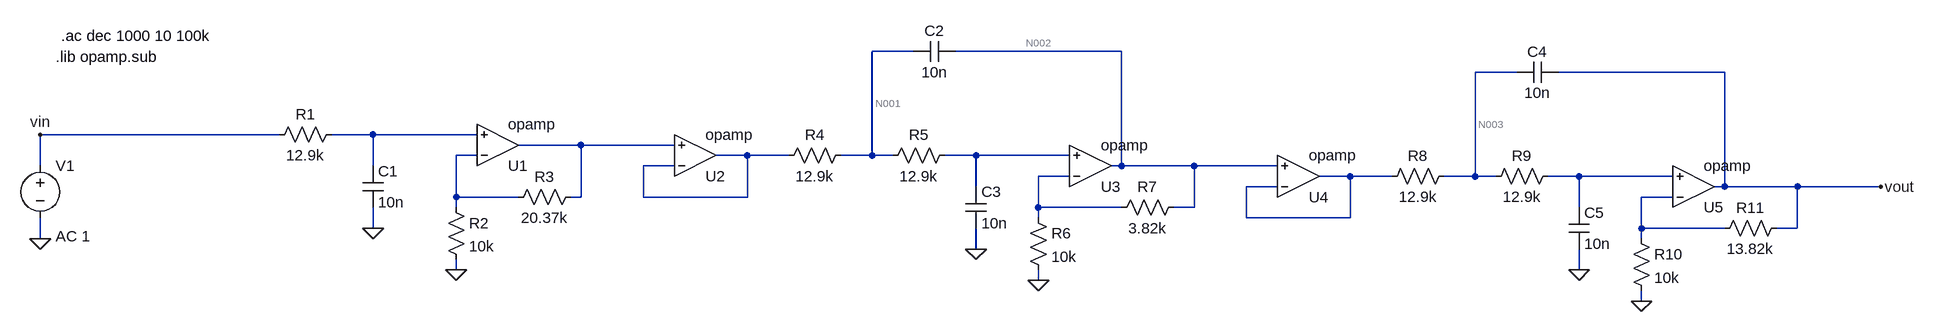
[diagram p0: schematic Draft1.asc]
Draft1.asc, the LTspice schematic file:
Version 4.1
SHEET 1 2884 680
WIRE 1328 -64 1264 -64
WIRE 1648 -64 1392 -64
WIRE 2256 -32 2192 -32
WIRE 2576 -32 2320 -32
WIRE 352 64 -16 64
WIRE 496 64 432 64
WIRE 656 64 496 64
WIRE 816 80 720 80
WIRE 960 80 816 80
WIRE 656 96 624 96
WIRE 1072 96 1024 96
WIRE 1136 96 1072 96
WIRE 1264 96 1264 -64
WIRE 1264 96 1216 96
WIRE 1296 96 1264 96
WIRE 1424 96 1376 96
WIRE 1568 96 1424 96
WIRE -16 112 -16 64
WIRE 496 112 496 64
WIRE 960 112 912 112
WIRE 1648 112 1648 -64
WIRE 1648 112 1632 112
WIRE 1760 112 1648 112
WIRE 1888 112 1760 112
WIRE 1568 128 1520 128
WIRE 2000 128 1952 128
WIRE 2064 128 2000 128
WIRE 2192 128 2192 -32
WIRE 2192 128 2144 128
WIRE 2224 128 2192 128
WIRE 2352 128 2304 128
WIRE 2496 128 2352 128
WIRE 1424 144 1424 96
WIRE 1888 144 1840 144
WIRE 2576 144 2576 -32
WIRE 2576 144 2560 144
WIRE 2688 144 2576 144
WIRE 2816 144 2688 144
WIRE 624 160 624 96
WIRE 720 160 624 160
WIRE 816 160 816 80
WIRE 816 160 800 160
WIRE 912 160 912 112
WIRE 1072 160 1072 96
WIRE 1072 160 912 160
WIRE 2496 160 2448 160
WIRE 624 176 624 160
WIRE 1520 176 1520 128
WIRE 1648 176 1520 176
WIRE 1760 176 1760 112
WIRE 1760 176 1728 176
WIRE 2352 176 2352 128
WIRE 1520 192 1520 176
WIRE 1840 192 1840 144
WIRE 2000 192 2000 128
WIRE 2000 192 1840 192
WIRE 496 208 496 176
WIRE 2448 208 2448 160
WIRE 2576 208 2448 208
WIRE 2688 208 2688 144
WIRE 2688 208 2656 208
WIRE -16 224 -16 192
WIRE 2448 224 2448 208
WIRE 1424 240 1424 208
WIRE 624 272 624 256
WIRE 2352 272 2352 240
WIRE 1520 288 1520 272
WIRE 2448 320 2448 304
FLAG -16 224 0
FLAG 496 208 0
FLAG 624 272 0
FLAG 1424 240 0
FLAG 1520 288 0
FLAG 2352 272 0
FLAG 2448 320 0
FLAG 2816 144 vout
FLAG -16 64 vin
SYMBOL voltage -16 96 R0
WINDOW 123 24 124 Left 2
WINDOW 39 0 0 Left 0
SYMATTR InstName V1
SYMATTR Value ""
SYMATTR Value2 AC 1
SYMBOL res 448 48 R90
WINDOW 0 0 56 VBottom 2
WINDOW 3 32 56 VTop 2
SYMATTR InstName R1
SYMATTR Value 12.9k
SYMBOL cap 480 112 R0
SYMATTR InstName C1
SYMATTR Value 10n
SYMBOL OpAmps\\opamp 688 144 M180
SYMATTR InstName U1
SYMBOL res 608 160 R0
SYMATTR InstName R2
SYMATTR Value 10k
SYMBOL res 816 144 R90
WINDOW 0 0 56 VBottom 2
WINDOW 3 32 56 VTop 2
SYMATTR InstName R3
SYMATTR Value 20.37k
SYMBOL OpAmps\\opamp 992 160 M180
SYMATTR InstName U2
SYMBOL res 1232 80 R90
WINDOW 0 0 56 VBottom 2
WINDOW 3 32 56 VTop 2
SYMATTR InstName R4
SYMATTR Value 12.9k
SYMBOL res 1280 112 R270
WINDOW 0 32 56 VTop 2
WINDOW 3 0 56 VBottom 2
SYMATTR InstName R5
SYMATTR Value 12.9k
SYMBOL cap 1392 -80 R90
WINDOW 0 0 32 VBottom 2
WINDOW 3 32 32 VTop 2
SYMATTR InstName C2
SYMATTR Value 10n
SYMBOL cap 1408 144 R0
SYMATTR InstName C3
SYMATTR Value 10n
SYMBOL res 1504 176 R0
SYMATTR InstName R6
SYMATTR Value 10k
SYMBOL res 1744 160 R90
WINDOW 0 0 56 VBottom 2
WINDOW 3 32 56 VTop 2
SYMATTR InstName R7
SYMATTR Value 3.82k
SYMBOL OpAmps\\opamp 1600 176 M180
SYMATTR InstName U3
SYMBOL OpAmps\\opamp 1920 192 M180
SYMATTR InstName U4
SYMBOL res 2160 112 R90
WINDOW 0 0 56 VBottom 2
WINDOW 3 32 56 VTop 2
SYMATTR InstName R8
SYMATTR Value 12.9k
SYMBOL res 2208 144 R270
WINDOW 0 32 56 VTop 2
WINDOW 3 0 56 VBottom 2
SYMATTR InstName R9
SYMATTR Value 12.9k
SYMBOL cap 2320 -48 R90
WINDOW 0 0 32 VBottom 2
WINDOW 3 32 32 VTop 2
SYMATTR InstName C4
SYMATTR Value 10n
SYMBOL cap 2336 176 R0
SYMATTR InstName C5
SYMATTR Value 10n
SYMBOL res 2432 208 R0
SYMATTR InstName R10
SYMATTR Value 10k
SYMBOL res 2672 192 R90
WINDOW 0 0 56 VBottom 2
WINDOW 3 32 56 VTop 2
SYMATTR InstName R11
SYMATTR Value 13.82k
SYMBOL OpAmps\\opamp 2528 208 M180
SYMATTR InstName U5
TEXT 8 -56 Left 2 !.lib opamp.sub
TEXT 16 -88 Left 2 !.ac dec 1000 10 100k

The netlist it stands for:
* Draft1.asc
V1 vin 0 AC 1
R1 N004 vin 12.9k
C1 N004 0 10n
X§U1 N006 N004 N005 opamp Aol=100K GBW=10Meg  ; pins invin noninvin out
R2 N006 0 10k
R3 N005 N006 20.37k
X§U2 N007 N005 N007 opamp Aol=100K GBW=10Meg  ; pins invin noninvin out
R4 N001 N007 12.9k
R5 N001 N008 12.9k
C2 N002 N001 10n
C3 N008 0 10n
R6 N009 0 10k
R7 N002 N009 3.82k
X§U3 N009 N008 N002 opamp Aol=100K GBW=10Meg  ; pins invin noninvin out
X§U4 N010 N002 N010 opamp Aol=100K GBW=10Meg  ; pins invin noninvin out
R8 N003 N010 12.9k
R9 N003 N011 12.9k
C4 vout N003 10n
C5 N011 0 10n
R10 N012 0 10k
R11 vout N012 13.82k
X§U5 N012 N011 vout opamp Aol=100K GBW=10Meg  ; pins invin noninvin out
.lib opamp.sub
.ac dec 1000 10 100k
.backanno
.end

* Results of the author's LTspice run, read from the files saved beside the schematic
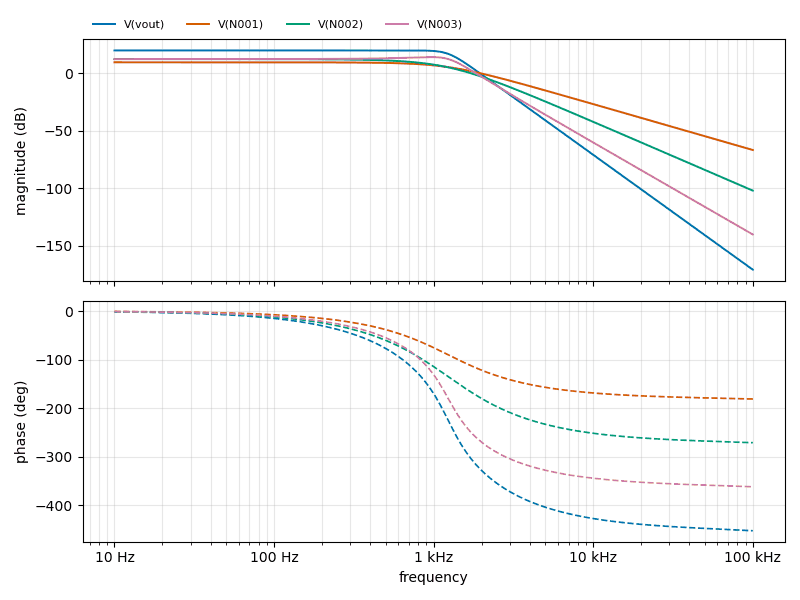
[diagram p1: AC Analysis of Draft1.asc, plotted from the saved traces]
* AC Analysis, 1 run:
*   V(vout): 20.00 dB at 10 Hz, -170.90 dB at 100 kHz, peak 20.00 dB at 460.3 Hz, 3 dB below the peak at 1.234 kHz
*   V(N001): 9.65 dB at 10 Hz, -66.71 dB at 100 kHz, peak 9.65 dB at 10 Hz, 3 dB below the peak at 1.06 kHz
*   V(N002): 12.46 dB at 10 Hz, -102.08 dB at 100 kHz, peak 12.46 dB at 10 Hz, 3 dB below the peak at 788.9 Hz
*   V(N003): 12.46 dB at 10 Hz, -140.26 dB at 100 kHz, peak 14.18 dB at 959.4 Hz, 3 dB below the peak at 1.313 kHz